# EAGLE schematic dc26-dev-board-apa102c (EAGLE 8.6.3)

## Sheet 1 of 7
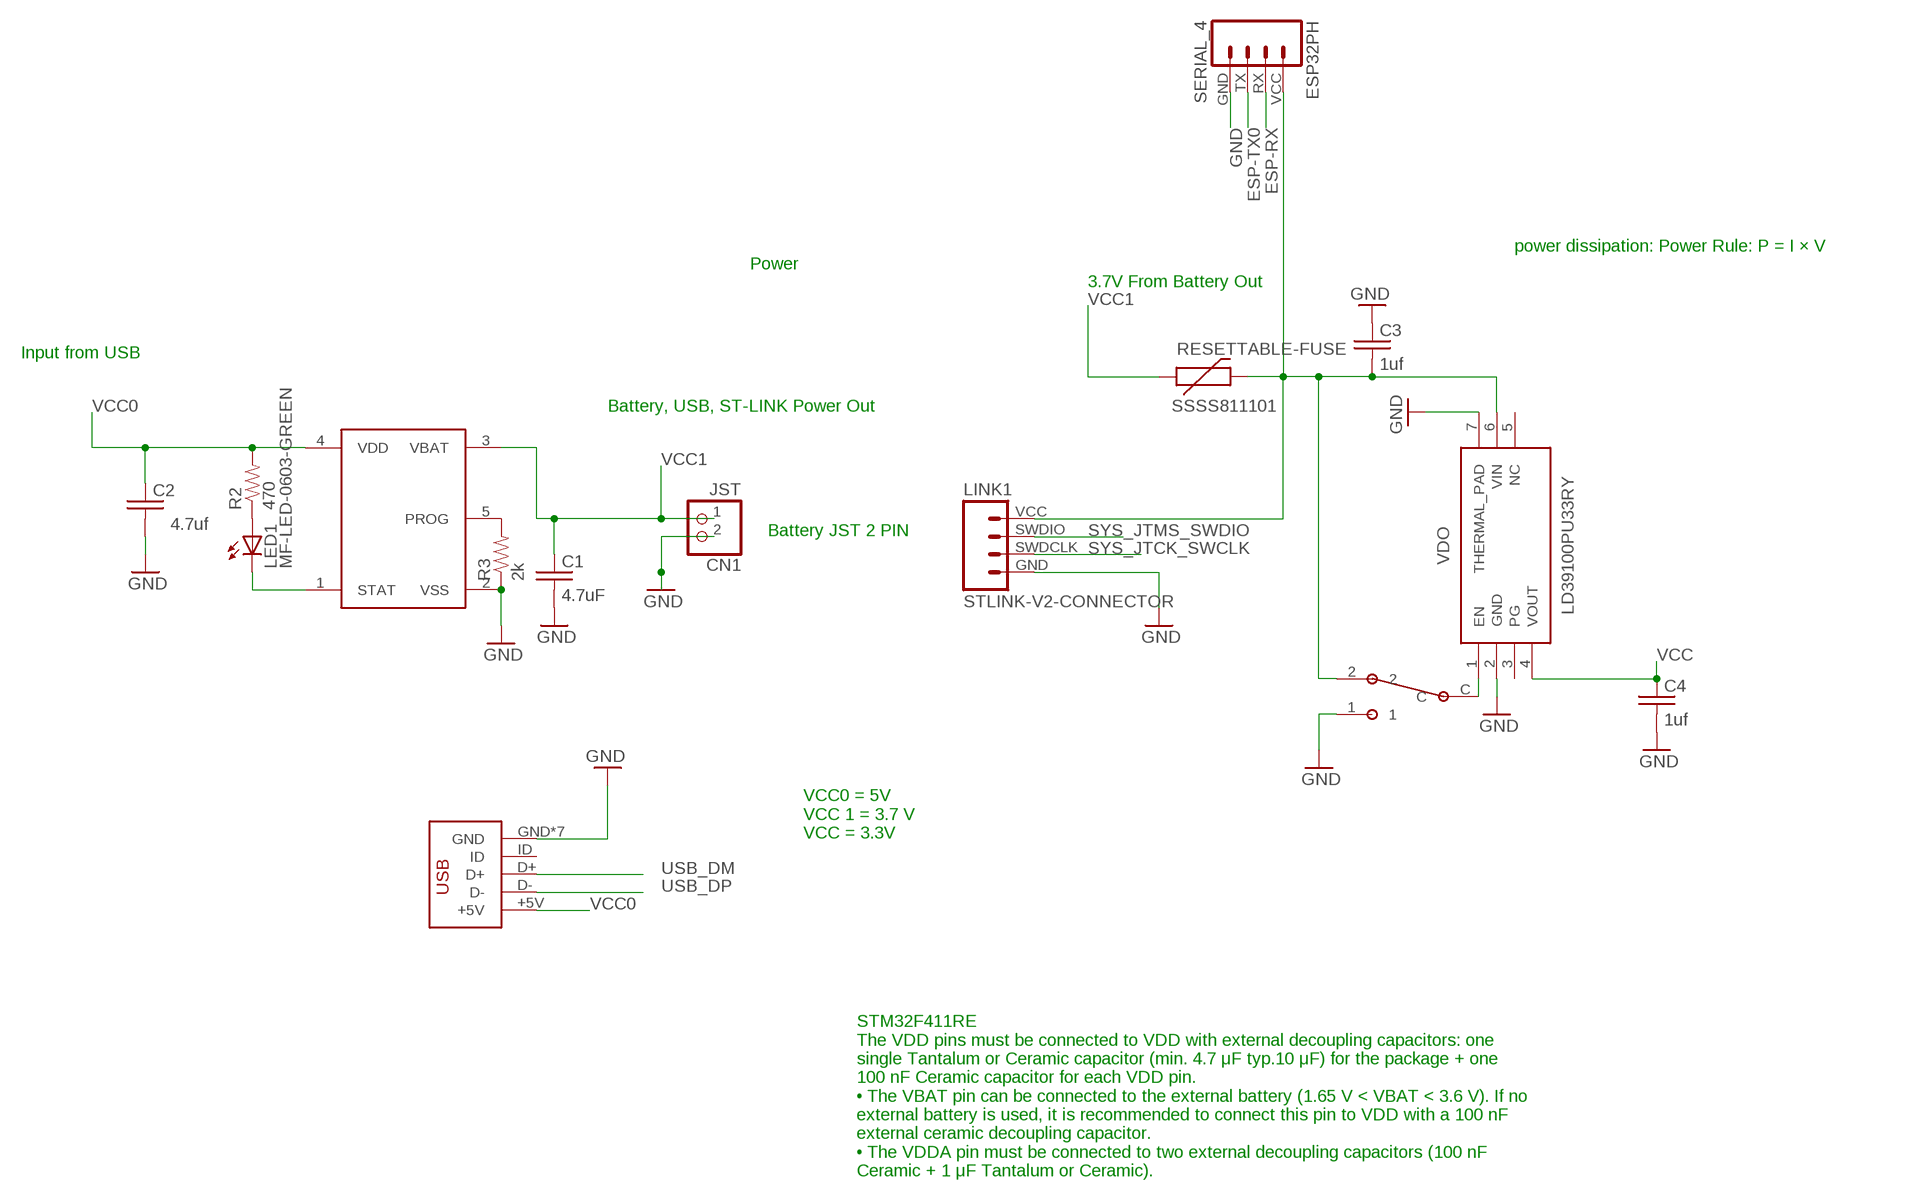
[diagram p0: schematic, sheet 1]

### Parts
C1  4.7uF  C-USC0805  [C0805]
C2  4.7uf  C-USC0805  [C0805]
C3  1uf  C-USC0805  [C0805]
C4  1uf  C-USC0805  [C0805]
CHARGING_CIRCUT  MCP73831  DS21984E  [SOT23-5]
CN1  JST  JST_2PIN-THM-RA  [JST-PH-2-THM-RA]
ESP32PH  SERIAL_4  [SERIAL_HEADER_4]
LED1  MF-LED-0603-GREEN  LED1206  [LED-1206]
LINK1  STLINK-V2-CONNECTOR  [1X04]
P1  SSSS811101  SWITCH_SPDT  [SPDT_SSAJ120100]
R2  470  RESISTOR0805-RES  [0805]
R3  2k  RESISTOR0805-RES  [0805]
RESETTABLE-FUSE  SSSS811101  PTCSMD  [PTC-1206]
USB  DX4R005JJ2DX4R005JJ2  [DX4R005JJ2]
VDO  LD39100PU33RY  [SON95P300X300X90-7N]

### Nets
ESP-RX: ESP32PH.RX ; also sheet 4
ESP-TX0: ESP32PH.TX ; also sheet 4
GND: C1.2 C2.2 C3.1 C4.2 CHARGING_CIRCUT.2(VSS) CN1.2 ESP32PH.GND LINK1.GND P1.1 R3.1 USB.GND USB.P$6(GND) USB.P$7(GND) USB.P$8(GND) USB.P$9(GND) USB.P$10(GND) USB.P$11(GND) VDO.2(GND) VDO.7(THERMAL_PAD) ; also sheet 2,3,4,5
N$1: LED1.A R2.1
N$2: CHARGING_CIRCUT.5(PROG) R3.2
N$3: CHARGING_CIRCUT.1(STAT) LED1.C
SYS_JTCK_SWCLK: LINK1.SWDCLK ; also sheet 2
SYS_JTMS_SWDIO: LINK1.SWDIO ; also sheet 2
USB_DM: USB.D+ ; also sheet 2
USB_DP: USB.D- ; also sheet 2
VCC: C4.1 VDO.4(VOUT) ; also sheet 2,4,5
VCC0: C2.1 CHARGING_CIRCUT.4(VDD) R2.2 USB.+5V
VCC1: C1.1 CHARGING_CIRCUT.3(VBAT) CN1.1 RESETTABLE-FUSE.1
VIN: C3.2 ESP32PH.VCC LINK1.VCC P1.2 RESETTABLE-FUSE.2 VDO.6(VIN) ; also sheet 3
VIN-EN: P1.C VDO.1(EN)
Unconnected: USB.ID VDO.3(PG) VDO.5(NC)

### Notes on the sheet
- power dissipation: Power Rule: P = I × V
- Power
- 3.7V From Battery Out
- Input from USB
- Battery, USB, ST-LINK Power Out
- Battery JST 2 PIN
- VCC0 = 5V
  VCC 1 = 3.7 V
  VCC = 3.3V
- STM32F411RE
  The VDD pins must be connected to VDD with external decoupling capacitors: one
  single Tantalum or Ceramic capacitor (min. 4.7 μF typ.10 μF) for the package + one
  100 nF Ceramic capacitor for each VDD pin.
  • The VBAT pin can be connected to the external battery (1.65 V < VBAT < 3.6 V). If no
  external battery is used, it is recommended to connect this pin to VDD with a 100 nF
  external ceramic decoupling capacitor.
  • The VDDA pin must be connected to two external decoupling capacitors (100 nF
  Ceramic + 1 μF Tantalum or Ceramic).

## Sheet 2 of 7
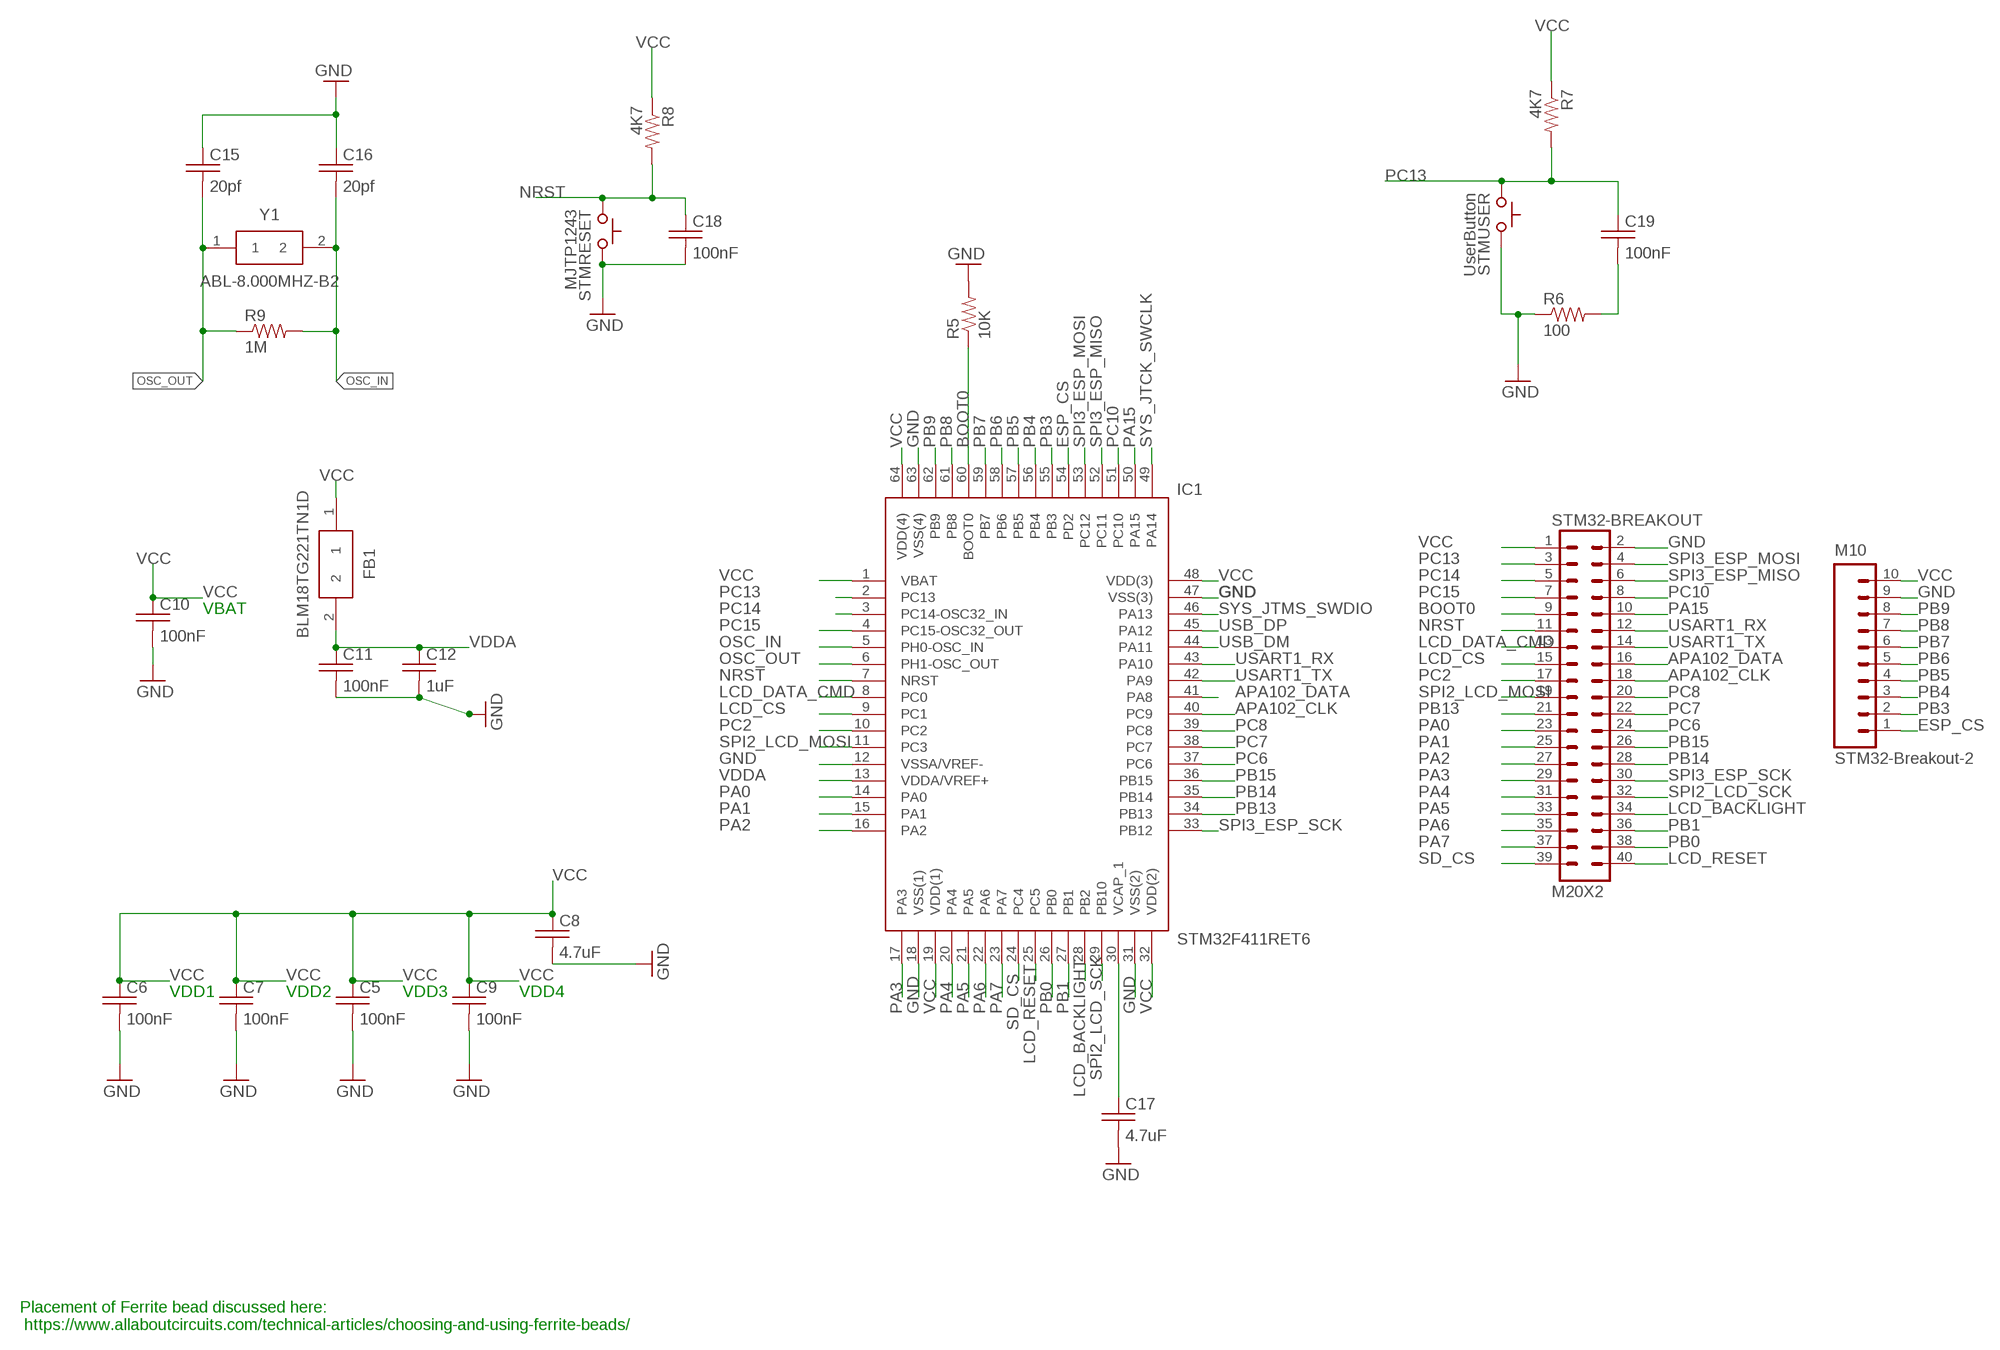
[diagram p1: schematic, sheet 2]

### Parts
C5  100nF  C-USC0805  [C0805]
C6  100nF  C-USC0805  [C0805]
C7  100nF  C-USC0805  [C0805]
C8  4.7uF  C-USC0805  [C0805]
C9  100nF  C-USC0805  [C0805]
C10  100nF  C-USC0805  [C0805]
C11  100nF  C-USC0805  [C0805]
C12  1uF  C-USC0805  [C0805]
C15  20pf  C-USC0805  [C0805]
C16  20pf  C-USC0805  [C0805]
C17  4.7uF  C-USC0805  [C0805]
C18  100nF  C-USC0805  [C0805]
C19  100nF  C-USC0805  [C0805]
FB1  BLM18TG221TN1D  [BEADC1608X75N]
IC1  STM32F411RET6  [QFP50P1200X1200X160-64N]
M10  STM32-Breakout-2  M10SILK_FEMALE_PTH  [1X10]
R5  10K  RESISTOR0805-RES  [0805]
R6  100  RESISTOR0805-RES  [0805]
R7  4K7  RESISTOR0805-RES  [0805]
R8  4K7  RESISTOR0805-RES  [0805]
R9  1M  RESISTOR0805-RES  [0805]
STM32-BREAKOUT  M20X2  [2X20]
STMRESET  MJTP1243  SWITCH_TACTILETACTILE-2PIN-NARROW  [TACTILE-2PIN-NARROW]
STMUSER  UserButton  SWITCH_TACTILETACTILE-2PIN-NARROW  [TACTILE-2PIN-NARROW]
Y1  ABL-8.000MHZ-B2  [HC/49US_(AT49)PTH]

### Nets
APA102_CLK: IC1.40(PC9) STM32-BREAKOUT.18 ; also sheet 3
APA102_DATA: IC1.41(PA8) STM32-BREAKOUT.16 ; also sheet 3
BOOT0: IC1.60(BOOT0) R5.1 STM32-BREAKOUT.9
ESP_CS: IC1.54(PD2) M10.1 ; also sheet 4
GND: C5.2 C6.2 C7.2 C8.2 C9.2 C10.2 C11.2 C12.2 C15.1 C16.1 C17.2 C18.2 IC1.12(VSSA/VREF-) IC1.18(VSS(1)) IC1.31(VSS(2)) IC1.47(VSS(3)) IC1.63(VSS(4)) M10.9 R5.2 R6.1 STM32-BREAKOUT.2 STMRESET.P$1(A) STMUSER.P$1(A) ; also sheet 1,3,4,5
LCD_BACKLIGHT: IC1.28(PB2) STM32-BREAKOUT.34 ; also sheet 5
LCD_CS: IC1.9(PC1) STM32-BREAKOUT.15 ; also sheet 5
LCD_DATA_CMD: IC1.8(PC0) STM32-BREAKOUT.13 ; also sheet 5
LCD_RESET: IC1.25(PC5) STM32-BREAKOUT.40 ; also sheet 5
N$4: C19.2 R6.2
N$20: C17.1 IC1.30(VCAP_1)
NRST: C18.1 IC1.7(NRST) R8.2 STM32-BREAKOUT.11 STMRESET.P$2(C)
OSC_IN: C16.2 IC1.5(PH0-OSC_IN) R9.2 Y1.2
OSC_OUT: C15.2 IC1.6(PH1-OSC_OUT) R9.1 Y1.1
PA0: IC1.14(PA0) STM32-BREAKOUT.23
PA1: IC1.15(PA1) STM32-BREAKOUT.25
PA2: IC1.16(PA2) STM32-BREAKOUT.27
PA3: IC1.17(PA3) STM32-BREAKOUT.29
PA4: IC1.20(PA4) STM32-BREAKOUT.31
PA5: IC1.21(PA5) STM32-BREAKOUT.33
PA6: IC1.22(PA6) STM32-BREAKOUT.35
PA7: IC1.23(PA7) STM32-BREAKOUT.37
PA15: IC1.50(PA15) STM32-BREAKOUT.10
PB0: IC1.26(PB0) STM32-BREAKOUT.38
PB1: IC1.27(PB1) STM32-BREAKOUT.36
PB3: IC1.55(PB3) M10.2
PB4: IC1.56(PB4) M10.3
PB5: IC1.57(PB5) M10.4
PB6: IC1.58(PB6) M10.5
PB7: IC1.59(PB7) M10.6
PB8: IC1.61(PB8) M10.7
PB9: IC1.62(PB9) M10.8
PB13: IC1.34(PB13) STM32-BREAKOUT.21
PB14: IC1.35(PB14) STM32-BREAKOUT.28
PB15: IC1.36(PB15) STM32-BREAKOUT.26
PC2: IC1.10(PC2) STM32-BREAKOUT.17
PC6: IC1.37(PC6) STM32-BREAKOUT.24
PC7: IC1.38(PC7) STM32-BREAKOUT.22
PC8: IC1.39(PC8) STM32-BREAKOUT.20
PC10: IC1.51(PC10) STM32-BREAKOUT.8
PC13: C19.1 IC1.2(PC13) R7.2 STM32-BREAKOUT.3 STMUSER.P$2(C)
PC14: IC1.3(PC14-OSC32_IN) STM32-BREAKOUT.5
PC15: IC1.4(PC15-OSC32_OUT) STM32-BREAKOUT.7
SD_CS: IC1.24(PC4) STM32-BREAKOUT.39 ; also sheet 5
SPI2_LCD_MOSI: IC1.11(PC3) STM32-BREAKOUT.19 ; also sheet 5
SPI2_LCD_SCK: IC1.29(PB10) STM32-BREAKOUT.32 ; also sheet 5
SPI3_ESP_MISO: IC1.52(PC11) STM32-BREAKOUT.6 ; also sheet 4,5
SPI3_ESP_MOSI: IC1.53(PC12) STM32-BREAKOUT.4 ; also sheet 4,5
SPI3_ESP_SCK: IC1.33(PB12) STM32-BREAKOUT.30 ; also sheet 4,5
SYS_JTCK_SWCLK: IC1.49(PA14) ; also sheet 1
SYS_JTMS_SWDIO: IC1.46(PA13) ; also sheet 1
USART1_RX: IC1.43(PA10) STM32-BREAKOUT.12
USART1_TX: IC1.42(PA9) STM32-BREAKOUT.14
USB_DM: IC1.44(PA11) ; also sheet 1
USB_DP: IC1.45(PA12) ; also sheet 1
VCC: C5.1 C6.1 C7.1 C8.1 C9.1 C10.1 FB1.1 IC1.1(VBAT) IC1.19(VDD(1)) IC1.32(VDD(2)) IC1.48(VDD(3)) IC1.64(VDD(4)) M10.10 R7.1 R8.1 STM32-BREAKOUT.1 ; also sheet 1,4,5
VDDA: C11.1 C12.1 FB1.2 IC1.13(VDDA/VREF+)

### Notes on the sheet
- VBAT
- VDD1 | VDD2 | VDD3 | VDD4
- Placement of Ferrite bead discussed here: 
   https://www.allaboutcircuits.com/technical-articles/choosing-and-using-ferrite-beads/

## Sheet 3 of 7
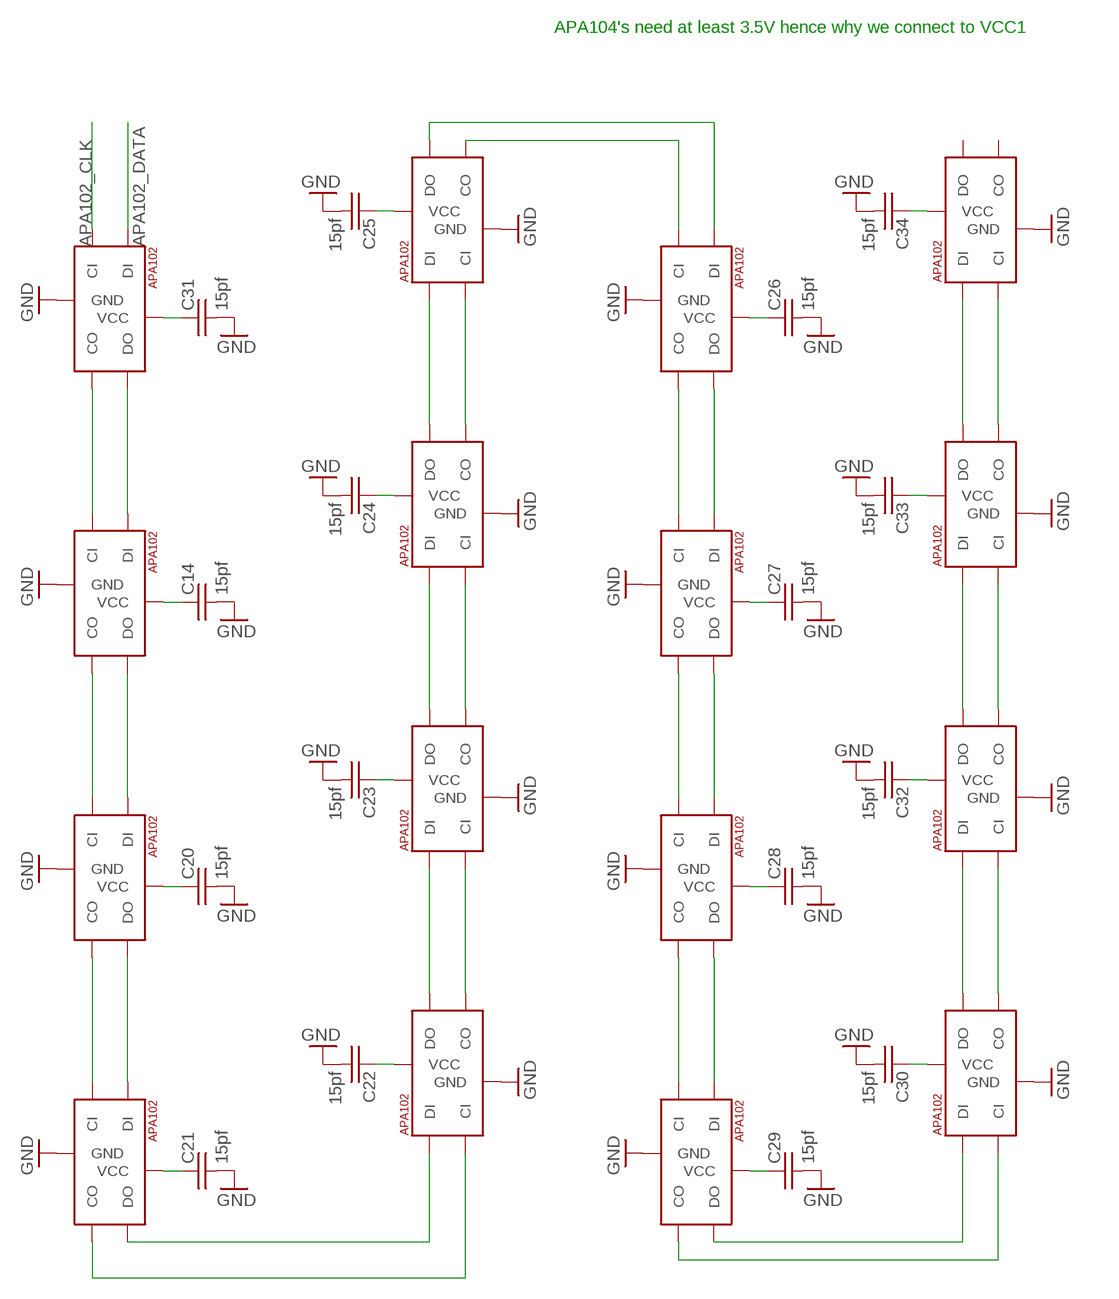
[diagram p2: schematic, sheet 3]

### Parts
C14  15pf  C-USC0805  [C0805]
C20  15pf  C-USC0805  [C0805]
C21  15pf  C-USC0805  [C0805]
C22  15pf  C-USC0805  [C0805]
C23  15pf  C-USC0805  [C0805]
C24  15pf  C-USC0805  [C0805]
C25  15pf  C-USC0805  [C0805]
C26  15pf  C-USC0805  [C0805]
C27  15pf  C-USC0805  [C0805]
C28  15pf  C-USC0805  [C0805]
C29  15pf  C-USC0805  [C0805]
C30  15pf  C-USC0805  [C0805]
C31  15pf  C-USC0805  [C0805]
C32  15pf  C-USC0805  [C0805]
C33  15pf  C-USC0805  [C0805]
C34  15pf  C-USC0805  [C0805]
U$5  APA1025050  [APA102_5050]
U$6  APA1025050  [APA102_5050]
U$7  APA1025050  [APA102_5050]
U$8  APA1025050  [APA102_5050]
U$9  APA1025050  [APA102_5050]
U$10  APA1025050  [APA102_5050]
U$11  APA1025050  [APA102_5050]
U$12  APA1025050  [APA102_5050]
U$13  APA1025050  [APA102_5050]
U$14  APA1025050  [APA102_5050]
U$15  APA1025050  [APA102_5050]
U$16  APA1025050  [APA102_5050]
U$17  APA1025050  [APA102_5050]
U$18  APA1025050  [APA102_5050]
U$19  APA1025050  [APA102_5050]
U$20  APA1025050  [APA102_5050]

### Nets
APA102_CLK: U$8.5(CI) ; also sheet 2
APA102_DATA: U$8.4(DI) ; also sheet 2
GND: C14.2 C20.2 C21.2 C22.2 C23.2 C24.2 C25.2 C26.2 C27.2 C28.2 C29.2 C30.2 C31.2 C32.2 C33.2 C34.2 U$5.6(GND) U$6.6(GND) U$7.6(GND) U$8.6(GND) U$9.6(GND) U$10.6(GND) U$11.6(GND) U$12.6(GND) U$13.6(GND) U$14.6(GND) U$15.6(GND) U$16.6(GND) U$17.6(GND) U$18.6(GND) U$19.6(GND) U$20.6(GND) ; also sheet 1,2,4,5
N$5: U$5.5(CI) U$8.2(CO)
N$6: U$5.2(CO) U$6.5(CI)
N$7: U$6.2(CO) U$7.5(CI)
N$8: U$6.3(DO) U$7.4(DI)
N$9: U$5.3(DO) U$6.4(DI)
N$10: U$5.4(DI) U$8.3(DO)
N$11: U$7.3(DO) U$9.4(DI)
N$12: U$7.2(CO) U$9.5(CI)
N$13: U$9.2(CO) U$10.5(CI)
N$14: U$9.3(DO) U$10.4(DI)
N$15: U$10.2(CO) U$11.5(CI)
N$16: U$10.3(DO) U$11.4(DI)
N$17: U$11.2(CO) U$12.5(CI)
N$18: U$11.3(DO) U$12.4(DI)
N$19: U$12.2(CO) U$13.5(CI)
N$21: U$12.3(DO) U$13.4(DI)
N$22: U$13.2(CO) U$14.5(CI)
N$23: U$13.3(DO) U$14.4(DI)
N$24: U$14.2(CO) U$15.5(CI)
N$25: U$14.3(DO) U$15.4(DI)
N$26: U$15.2(CO) U$16.5(CI)
N$27: U$15.3(DO) U$16.4(DI)
N$28: U$16.3(DO) U$17.4(DI)
N$29: U$16.2(CO) U$17.5(CI)
N$30: U$17.3(DO) U$18.4(DI)
N$31: U$17.2(CO) U$18.5(CI)
N$32: U$18.2(CO) U$19.5(CI)
N$33: U$18.3(DO) U$19.4(DI)
N$34: U$19.2(CO) U$20.5(CI)
N$35: U$19.3(DO) U$20.4(DI)
VIN: C14.1 C20.1 C21.1 C22.1 C23.1 C24.1 C25.1 C26.1 C27.1 C28.1 C29.1 C30.1 C31.1 C32.1 C33.1 C34.1 U$5.1(VCC) U$6.1(VCC) U$7.1(VCC) U$8.1(VCC) U$9.1(VCC) U$10.1(VCC) U$11.1(VCC) U$12.1(VCC) U$13.1(VCC) U$14.1(VCC) U$15.1(VCC) U$16.1(VCC) U$17.1(VCC) U$18.1(VCC) U$19.1(VCC) U$20.1(VCC) ; also sheet 1
Unconnected: U$20.2(CO) U$20.3(DO)

### Notes on the sheet
- APA104's need at least 3.5V hence why we connect to VCC1

## Sheet 4 of 7
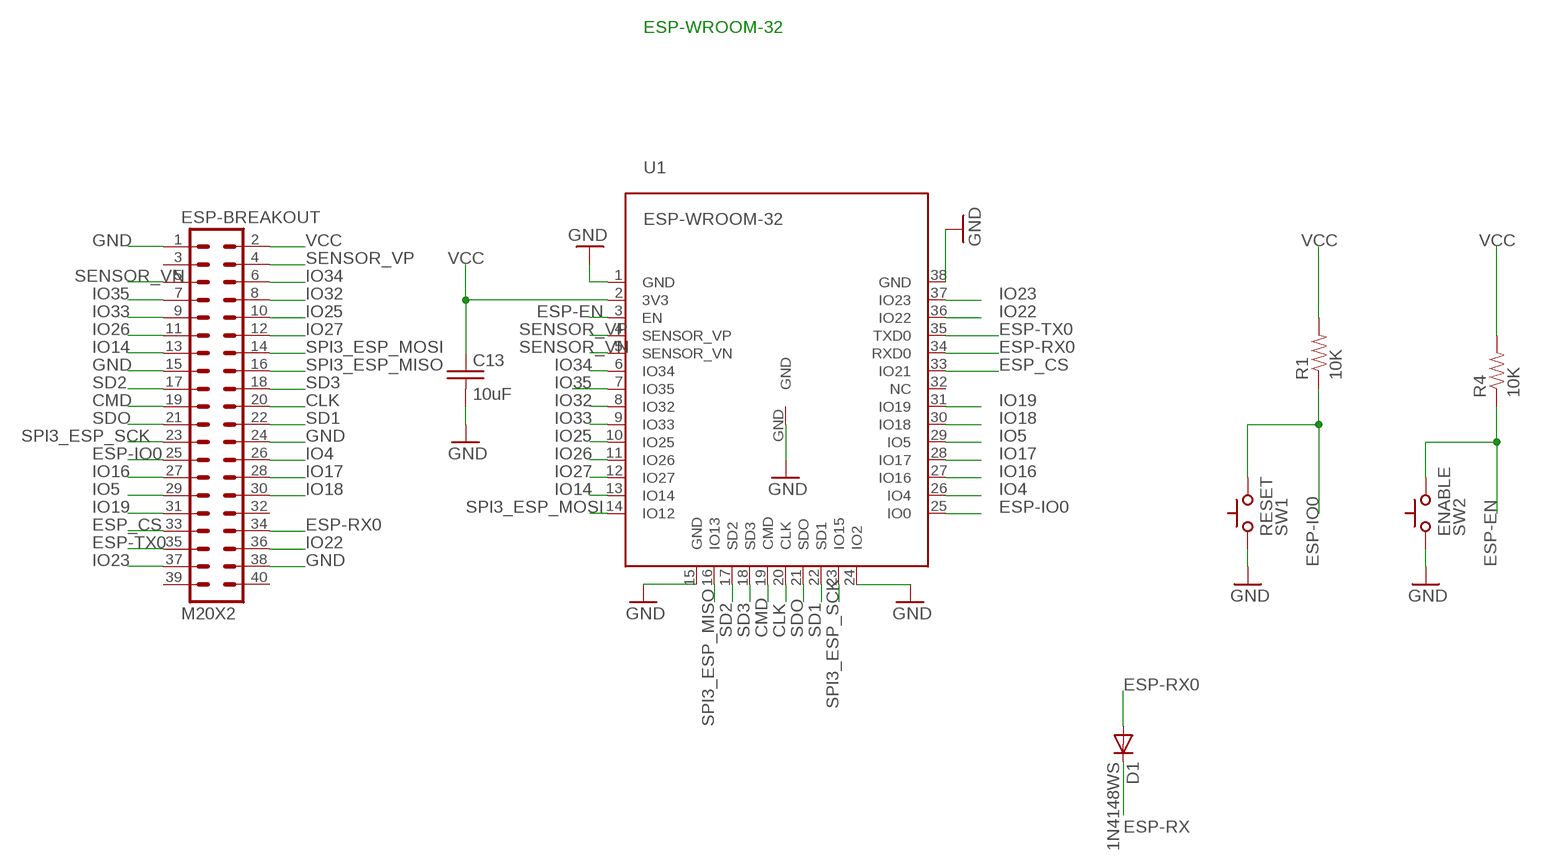
[diagram p3: schematic, sheet 4]

### Parts
C13  10uF  C-USC0805  [C0805]
D1  1N4148WS  DIODESOD  [SOD-323]
ENABLE  SW2  SWITCH_TACTILETACTILE-2PIN-NARROW  [TACTILE-2PIN-NARROW]
ESP-BREAKOUT  M20X2  [2X20]
R1  10K  RESISTOR0805-RES  [0805]
R4  10K  RESISTOR0805-RES  [0805]
RESET  SW1  SWITCH_TACTILETACTILE-2PIN-NARROW  [TACTILE-2PIN-NARROW]
U1  ESP-WROOM-32  [ESP-WROOM-32]

### Nets
CLK: ESP-BREAKOUT.20 U1.20(CLK)
CMD: ESP-BREAKOUT.19 U1.19(CMD)
ESP-EN: ENABLE.P$1(A) R4.1 U1.3(EN)
ESP-IO0: ESP-BREAKOUT.25 R1.1 RESET.P$1(A) U1.25(IO0)
ESP-RX: D1.1(C) ; also sheet 1
ESP-RX0: D1.2(A) ESP-BREAKOUT.34 U1.34(RXD0)
ESP-TX0: ESP-BREAKOUT.35 U1.35(TXD0) ; also sheet 1
ESP_CS: ESP-BREAKOUT.33 U1.33(IO21) ; also sheet 2
GND: C13.2 ENABLE.P$2(C) ESP-BREAKOUT.1 ESP-BREAKOUT.15 ESP-BREAKOUT.24 ESP-BREAKOUT.38 RESET.P$2(C) U1.1(GND) U1.15(GND) U1.24(IO2) U1.38(GND) U1.GND ; also sheet 1,2,3,5
IO4: ESP-BREAKOUT.26 U1.26(IO4)
IO5: ESP-BREAKOUT.29 U1.29(IO5)
IO14: ESP-BREAKOUT.13 U1.13(IO14)
IO16: ESP-BREAKOUT.27 U1.27(IO16)
IO17: ESP-BREAKOUT.28 U1.28(IO17)
IO18: ESP-BREAKOUT.30 U1.30(IO18)
IO19: ESP-BREAKOUT.31 U1.31(IO19)
IO22: ESP-BREAKOUT.36 U1.36(IO22)
IO23: ESP-BREAKOUT.37 U1.37(IO23)
IO25: ESP-BREAKOUT.10 U1.10(IO25)
IO26: ESP-BREAKOUT.11 U1.11(IO26)
IO27: ESP-BREAKOUT.12 U1.12(IO27)
IO32: ESP-BREAKOUT.8 U1.8(IO32)
IO33: ESP-BREAKOUT.9 U1.9(IO33)
IO34: ESP-BREAKOUT.6 U1.6(IO34)
IO35: ESP-BREAKOUT.7 U1.7(IO35)
SD1: ESP-BREAKOUT.22 U1.22(SD1)
SD2: ESP-BREAKOUT.17 U1.17(SD2)
SD3: ESP-BREAKOUT.18 U1.18(SD3)
SDO: ESP-BREAKOUT.21 U1.21(SDO)
SENSOR_VN: ESP-BREAKOUT.5 U1.5(SENSOR_VN)
SENSOR_VP: ESP-BREAKOUT.4 U1.4(SENSOR_VP)
SPI3_ESP_MISO: ESP-BREAKOUT.16 U1.16(IO13) ; also sheet 2,5
SPI3_ESP_MOSI: ESP-BREAKOUT.14 U1.14(IO12) ; also sheet 2,5
SPI3_ESP_SCK: ESP-BREAKOUT.23 U1.23(IO15) ; also sheet 2,5
VCC: C13.1 ESP-BREAKOUT.2 R1.2 R4.2 U1.2(3V3) ; also sheet 1,2,5
Unconnected: ESP-BREAKOUT.3 ESP-BREAKOUT.32 ESP-BREAKOUT.39 ESP-BREAKOUT.40 U1.32(NC)

### Notes on the sheet
- ESP-WROOM-32

## Sheet 5 of 7
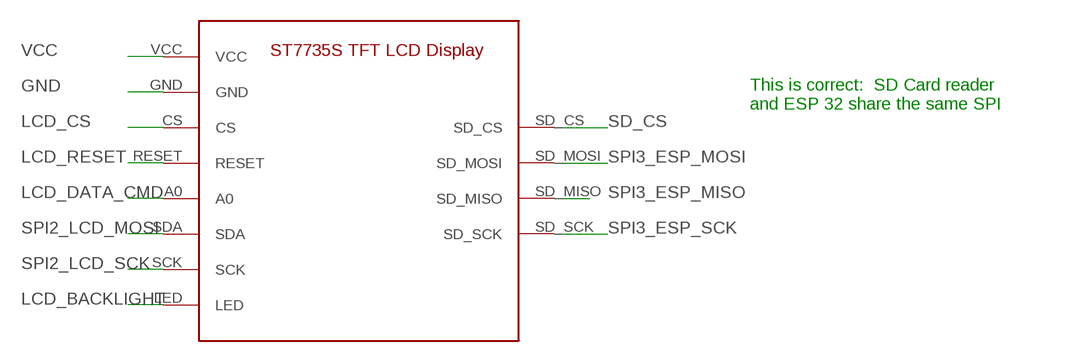
[diagram p4: schematic, sheet 5]

### Parts
U$1  ST7735S_LCD_MODULE  [ST7735S_LCD_DISPLAY]

### Nets
GND: U$1.GND ; also sheet 1,2,3,4
LCD_BACKLIGHT: U$1.LED ; also sheet 2
LCD_CS: U$1.CS ; also sheet 2
LCD_DATA_CMD: U$1.A0 ; also sheet 2
LCD_RESET: U$1.RESET ; also sheet 2
SD_CS: U$1.SD_CS ; also sheet 2
SPI2_LCD_MOSI: U$1.SDA ; also sheet 2
SPI2_LCD_SCK: U$1.SCK ; also sheet 2
SPI3_ESP_MISO: U$1.SD_MISO ; also sheet 2,4
SPI3_ESP_MOSI: U$1.SD_MOSI ; also sheet 2,4
SPI3_ESP_SCK: U$1.SD_SCK ; also sheet 2,4
VCC: U$1.VCC ; also sheet 1,2,4

### Notes on the sheet
- This is correct:  SD Card reader
  and ESP 32 share the same SPI

## Sheet 6 of 7
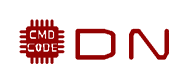
[diagram p5: schematic, sheet 6]

### Parts
U$2  CMD_C0DE_LOGO  [CMD_C0DE_LOGO]
U$3  DARKNET_DD  [DARKNET_D]
U$4  DARKNET_NN  [DARKNET_N]

## Sheet 7 of 7
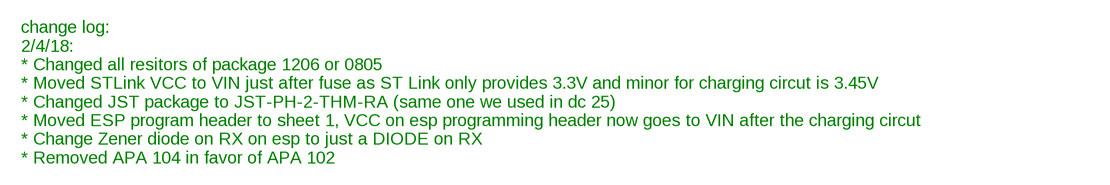
[diagram p6: schematic, sheet 7]

### Notes on the sheet
- change log:
  2/4/18:  
  * Changed all resitors of package 1206 or 0805
  * Moved STLink VCC to VIN just after fuse as ST Link only provides 3.3V and minor for charging circut is 3.45V
  * Changed JST package to JST-PH-2-THM-RA (same one we used in dc 25)
  * Moved ESP program header to sheet 1, VCC on esp programming header now goes to VIN after the charging circut
  * Change Zener diode on RX on esp to just a DIODE on RX 
  * Removed APA 104 in favor of APA 102

## Library data of the parts
C1-C34 = dc-26:C-US: CAPACITOR, American symbol
CHARGING_CIRCUT = dc-26:DS21984E
CN1 = dc-26:JST_2PIN: JST 2-Pin Connectors of various flavors SMT-RA (S2B-PH-SM4) 4UConnector #17311 SMT (B2B-PH-SM4) THM-RA (S2B-PH) THM (B2B-PH)
D1 = dc-26:DIODE: Diode These are standard reverse protection diodes and small signal diodes. SMA package can handle up to about 1A. SOD-323 can handle about 200mA. What the SOD-323 package when ordering, there are some mfgs out there that are 5-pin packages.; PROD_ID: DIO-09646
ENABLE RESET STMRESET STMUSER = dc-26:SWITCH_TACTILE
ESP32PH = dc-26:SERIAL_4
ESP-BREAKOUT STM32-BREAKOUT = dc-26:M20X2: 0.1" spaced headers
FB1 = dc-26:BLM18TG221TN1D: Ferrite bead SMD 0603 220R Murata Ferrite Bead (Chip Ferrite Bead), 1.6 x 0.8 x 0.6mm (0603), 1000 impedance at 100 MHz <https://componentsearchengine.com/Images/3/BLM18TG221TN1D.jpg> Source: Datasheet <http://www.murata.com/~/media/webrenewal/support/library/catalog/products/emc/emifil/c31e.ashx?la=en-gb>; DESCRIPTION: Ferrite bead SMD 0603 220R Murata Ferrite Bead (Chip Ferrite Bead), 1.6 x 0.8 x 0.6mm (0603), 1000 impedance at 100 MHz; HEIGHT: 0.75mm; MANUFACTURER_NAME: Murata Electronics; MANUFACTURER_PART_NUMBER: BLM18TG221TN1D; RS_PART_NUMBER: 6197526; SUPPLIER_NAME: RS
IC1 = STM32F411RET6:STM32F411RET6: 32-Bit MCU+DSP 512K Flash 100MHz LQFP64 STMicroelectronics STM32F411RET6, 32bit ARM Cortex M4 MCU, 100MHz, 512 kB Flash, 64-Pin LQFP <https://componentsearchengine.com/Images/1/STM32F411RET6.jpg> Source: Datasheet <http://www.farnell.com/datasheets/2042639.pdf>; DESCRIPTION: 32-Bit MCU+DSP 512K Flash 100MHz LQFP64 STMicroelectronics STM32F411RET6, 32bit ARM Cortex M4 MCU, 100MHz, 512 kB Flash, 64-Pin LQFP; HEIGHT: 1.6mm; MANUFACTURER_NAME: STMicroelectronics; MANUFACTURER_PART_NUMBER: STM32F411RET6; RS_PART_NUMBER: 1106617P; SUPPLIER_NAME: RS
LED1 = dc-26:LED: LEDs Standard schematic elements and footprints for 5mm, 3mm, 1206, and 0603 sized LEDs. 5mm - Spark Fun Electronics SKU : COM-00529 (and others)
LINK1 = dc-26:STLINK-V2-CONNECTOR
M10 = dc-26:M10: Header 10 Standard 10-pin 0.1" header. Use with straight break away headers (SKU : PRT-00116), right angle break away headers (PRT-00553), swiss pins (PRT-00743), machine pins (PRT-00117), and female headers (PRT-00115).; PROD_ID: CONN-11563
P1 = dc-26:SWITCH_SPDT
R1-R9 = dc-26:RESISTOR: Resistor Basic schematic elements and footprints for 0603, 1206, and PTH resistors.
RESETTABLE-FUSE = dc-26:PTC: Resettable Fuse PTC Resettable Fuse. Spark Fun Electronics SKU : COM-08357; PROD_ID: RES-11150
U1 = dc-26:ESP-WROOM-32
U$1 = dc-26:ST7735S_LCD_MODULE
U$2 = dc-26:CMD_C0DE_LOGO
U$3 = dc-26:DARKNET_D
U$4 = dc-26:DARKNET_N
U$5-U$20 = dc-26:APA102: APA102C 5050 RGB LED -- Adafruit DotStar Single LED Pixel Product Page: https://www.adafruit.com/products/2343 Datasheet: https://cdn-shop.adafruit.com/product-files/2343/APA102C.pdf
USB = dc-26:DX4R005JJ2
VDO = dc-26:LD39100PU33RY: LDO Voltage Regulators 1 A low quiescent current low noise voltage regulator <https://componentsearchengine.com/Images/9/LD39100PU33RY.jpg> Source: Datasheet <http://www.st.com/content/ccc/resource/technical/document/datasheet/72/02/e5/ee/df/36/40/5e/CD00233788.pdf/files/CD00233788.pdf/jcr:content/translations/en.CD00233788.pdf>; DESCRIPTION: LDO Voltage Regulators 1 A low quiescent current low noise voltage regulator; HEIGHT: 0.9mm; MANUFACTURER_NAME: STMicroelectronics; MANUFACTURER_PART_NUMBER: LD39100PU33RY; SUPPLIER_NAME: RS
Y1 = ABL-8.000MHZ-B2:ABL-8.000MHZ-B2: ABRACON - ABL-8.000MHZ-B2 - CRYSTAL, 8MHZ, 18PF, HC-49US <https://componentsearchengine.com/Images/9/ABL-8.000MHZ-B2.jpg> Source: Datasheet <http://www.abracon.com/Resonators/ABL.pdf>; DESCRIPTION: ABRACON - ABL-8.000MHZ-B2 - CRYSTAL, 8MHZ, 18PF, HC-49US; HEIGHT: mm; MANUFACTURER_NAME: ABRACON; MANUFACTURER_PART_NUMBER: ABL-8.000MHZ-B2; SUPPLIER_NAME: RS